# EAGLE board UHJ Ambisonic Decoder (EAGLE 9.0.1), part 1 of 2
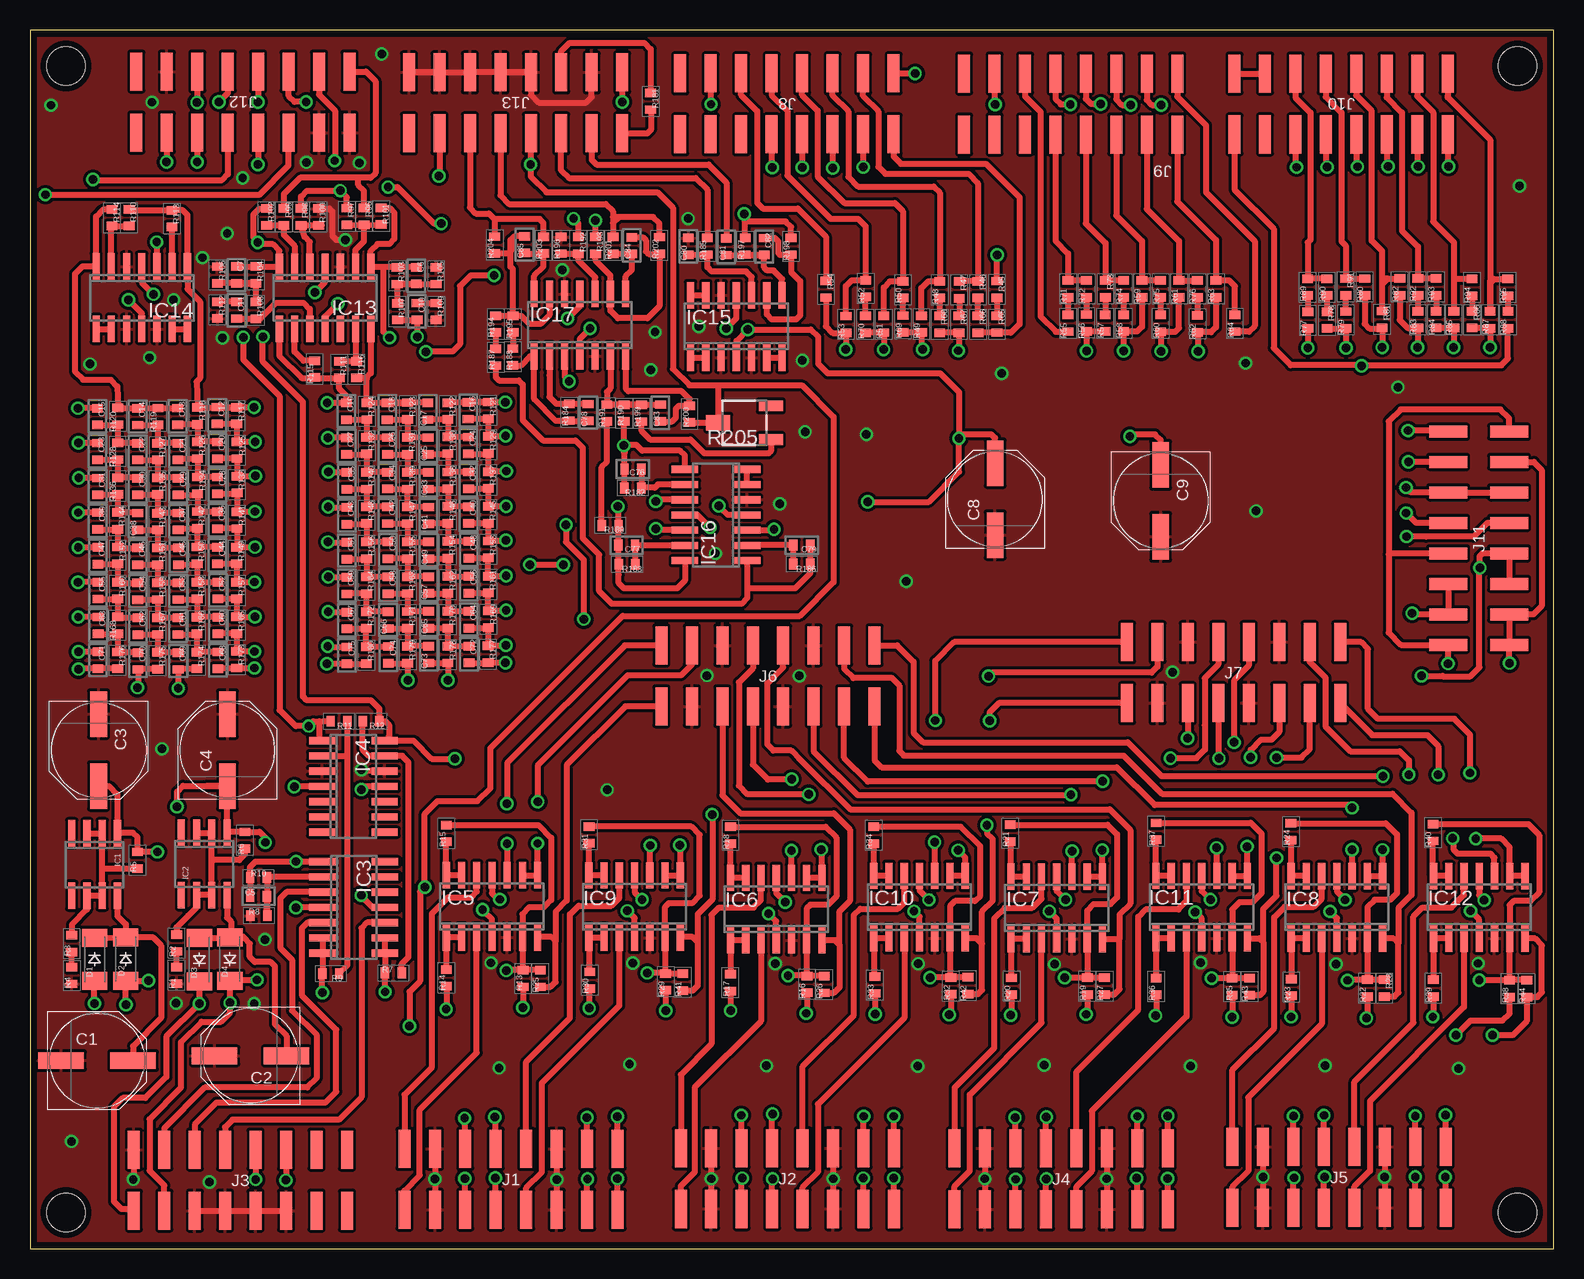
[diagram p5: board, top side]
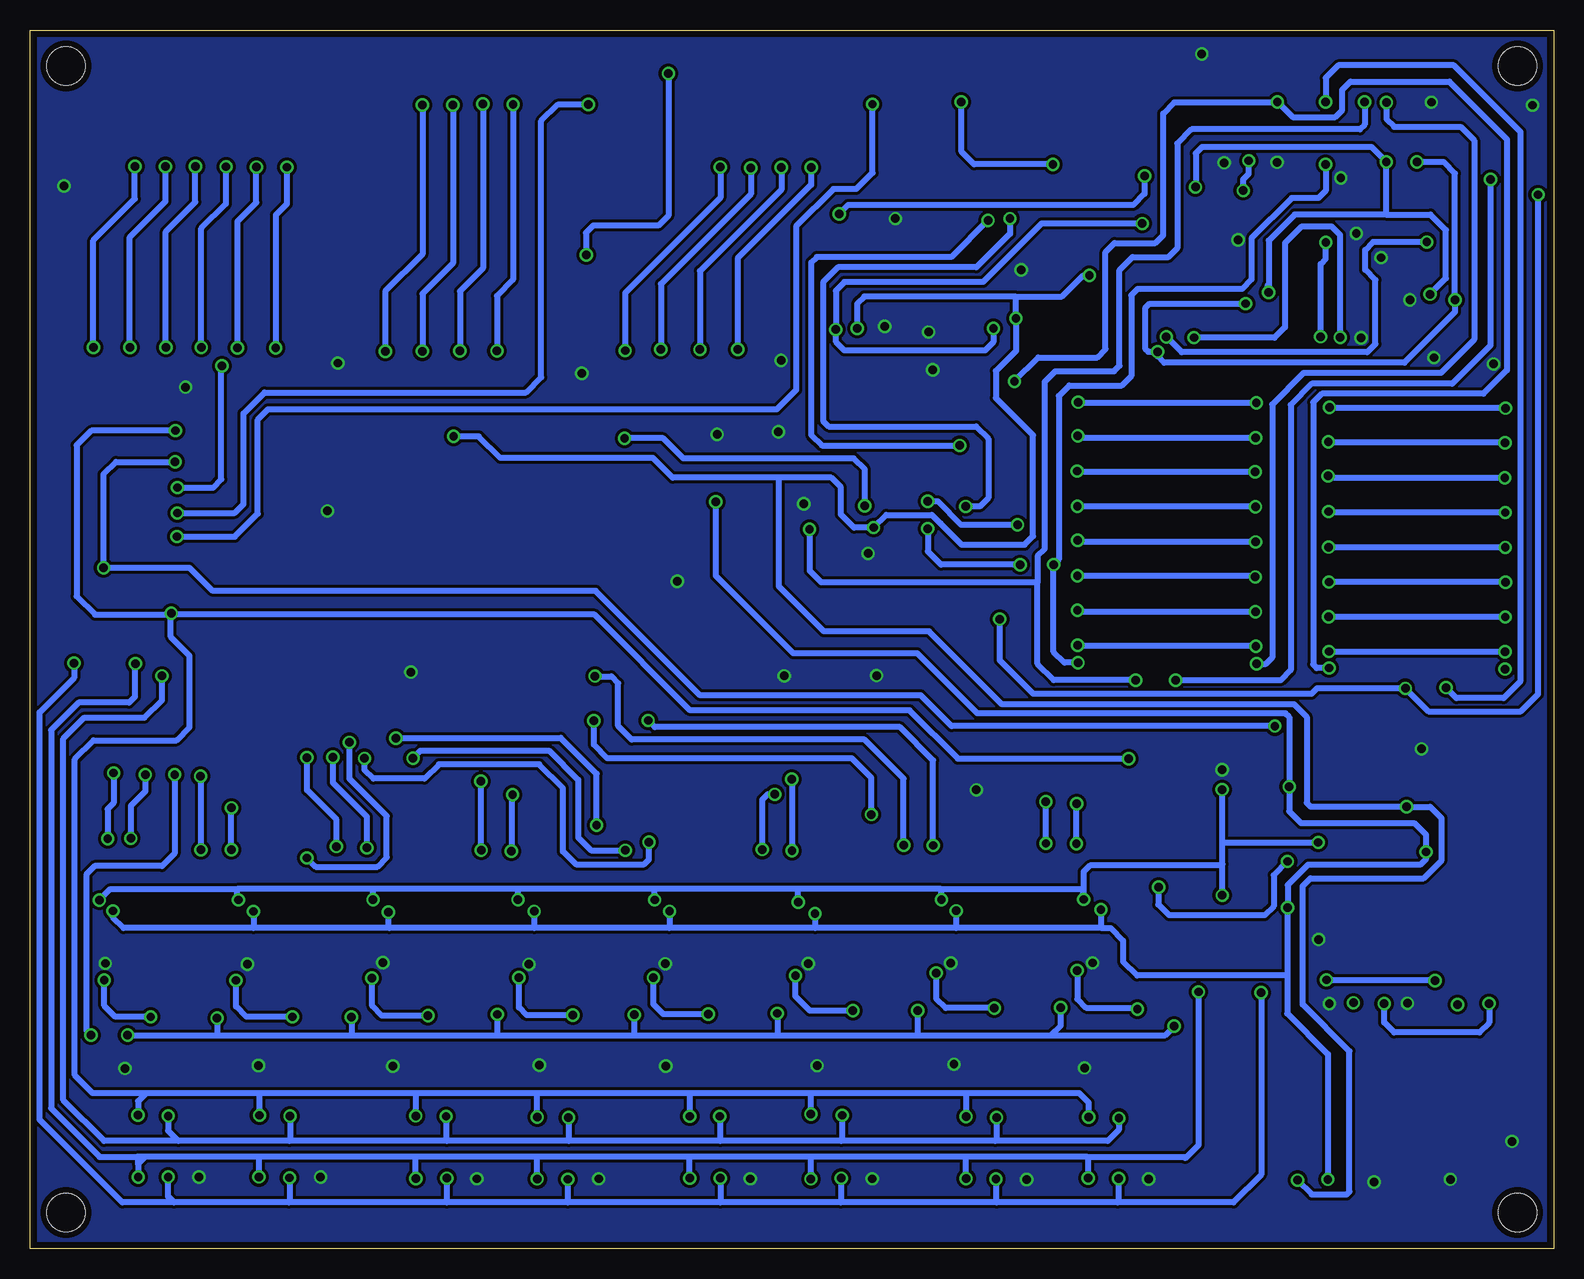
[diagram p6: board, bottom side, seen from below]

Size 127 x 101.6 mm. Coordinates in mm from the lower left corner, seen from the top.
Outline: 0,0 127,0 127,101.6 0,101.6 0,0
Copper layers (1*16): Top 0.035mm / dielectric 1.5mm / Bottom 0.035mm
Design rules "default *": minimum track width 6mil, minimum drill 0.2mm, track to track 10mil, track to pad 15mil, pad to pad 15mil, via to via 10mil, smd to smd 10mil, copper to edge 20mil, drill to drill 10mil, minimum pad ring 10mil, minimum via ring 8mil, stop-mask expansion 4mil, vias tented up to drill 0mil, thermal gap 10mil
Holes 3.2 mm at 3,98.6 124,98.6 3,3 124,3

## Footprints (pad centres in the part's own frame; a part is rotated, then mirrored left to right if it is on the bottom)
PANASONIC_E = smd 3.8 x 1.4: + 3,0; - -3,0
CT6032 = smd 0.7 x 0.9: + -0.7,0; - 0.7,0
SOD123 = smd 1.5 x 2.1: A 1.8,0; C -1.8,0
SO08 = smd 0.6 x 2.2: 1 -1.905,-2.6; 2 -0.635,-2.6; 3 0.635,-2.6; 4 1.905,-2.6; 5 1.905,2.6; 6 0.635,2.6; 7 -0.635,2.6; 8 -1.905,2.6
SO14 = smd 0.6 x 2.2: 1 -3.81,-2.6; 2 -2.54,-2.6; 3 -1.27,-2.6; 4 0,-2.6; 5 1.27,-2.6; 6 2.54,-2.6; 7 3.81,-2.6; 8 3.81,2.6; 9 2.54,2.6; 10 1.27,2.6; 11 0,2.6; 12 -1.27,2.6; 13 -2.54,2.6; 14 -3.81,2.6
2X08SMT = smd 1 x 3.17: 1 -8.89,-2.54; 2 -8.89,2.54; 3 -6.35,-2.54; 4 -6.35,2.54; 5 -3.81,-2.54; 6 -3.81,2.54; 7 -1.27,-2.54; 8 -1.27,2.54; 9 1.27,-2.54; 10 1.27,2.54; 11 3.81,-2.54; 12 3.81,2.54; 13 6.35,-2.54; 14 6.35,2.54; 15 8.89,-2.54; 16 8.89,2.54
R6332W = smd 0.7 x 0.9: 1 -0.7,0; 2 0.7,0
TRIM = smd 2 x 0.9: 1 -2.2,1.4; 3 -2.2,-1.4 | smd 2 x 1.3: 2 2.2,0

## Placement (x,y rotation side)
C1  470UF  [PANASONIC_E]  5.59,15.69 0 top
C2  470UF  [PANASONIC_E]  18.39,16.08 180 top
C3  10UF  [PANASONIC_E]  5.72,41.57 270 top
C4  10UF  [PANASONIC_E]  16.46,41.57 90 top
C5  22PF  [CT6032]  19.05,29.38 0 top
C6  C  [CT6032]  32.21,81.12 270 top
C7  C  [CT6032]  17.22,81.18 270 top
C8  C+  [PANASONIC_E]  80.45,62.49 90 top
C9  C+  [PANASONIC_E]  94.25,62.35 270 top
C10  C  [CT6032]  32.26,78.13 90 top
C11  C  [CT6032]  17.23,78.24 270 top
C12  100NF  [CT6032]  15.6,69.46 90 top
C13  100NF  [CT6032]  12.32,69.38 90 top
C14  100NF  [CT6032]  8.98,69.36 90 top
C15  100NF  [CT6032]  5.62,69.37 90 top
C16  100NF  [CT6032]  36.53,69.86 90 top
C17  100NF  [CT6032]  33.17,69.82 90 top
C18  100NF  [CT6032]  29.78,69.81 90 top
C19  100NF  [CT6032]  26.38,69.81 90 top
C20  47NF  [CT6032]  15.62,66.55 90 top
C21  47NF  [CT6032]  12.34,66.45 90 top
C22  47NF  [CT6032]  8.98,66.45 90 top
C23  47NF  [CT6032]  5.63,66.46 90 top
C24  47NF  [CT6032]  36.54,66.96 90 top
C25  47NF  [CT6032]  33.19,66.92 90 top
C26  47NF  [CT6032]  29.8,66.92 90 top
C27  47NF  [CT6032]  26.39,66.91 90 top
C28  22NF  [CT6032]  15.62,63.63 90 top
C29  22NF  [CT6032]  12.35,63.54 90 top
C30  22NF  [CT6032]  8.98,63.54 90 top
C31  22NF  [CT6032]  5.65,63.55 90 top
C32  22NF  [CT6032]  36.55,64.05 90 top
C33  22NF  [CT6032]  33.21,64.03 90 top
C34  22NF  [CT6032]  29.8,64.04 90 top
C35  22NF  [CT6032]  26.41,64.01 90 top
C36  12NF  [CT6032]  15.62,60.72 90 top
C37  12NF  [CT6032]  12.36,60.63 90 top
C38  12NF  [CT6032]  8.98,60.63 90 top
C39  12NF  [CT6032]  5.64,60.67 90 top
C40  12NF  [CT6032]  36.57,61.16 90 top
C41  12NF  [CT6032]  33.22,61.13 90 top
C42  12NF  [CT6032]  29.82,61.15 90 top
C43  12NF  [CT6032]  26.41,61.1 90 top
C44  6.8NF  [CT6032]  15.63,57.79 90 top
C45  6.8NF  [CT6032]  12.37,57.73 90 top
C46  6.8NF  [CT6032]  8.99,57.72 90 top
C47  6.8NF  [CT6032]  5.66,57.76 90 top
C48  6.8NF  [CT6032]  36.58,58.26 90 top
C49  6.8NF  [CT6032]  33.23,58.23 90 top
C50  6.8NF  [CT6032]  29.84,58.22 90 top
C51  6.8NF  [CT6032]  26.41,58.19 90 top
C52  3.3NF  [CT6032]  15.66,54.87 90 top
C53  3.3NF  [CT6032]  12.35,54.82 90 top
C54  3.3NF  [CT6032]  8.99,54.81 90 top
C55  3.3NF  [CT6032]  5.67,54.86 90 top
C56  3.3NF  [CT6032]  36.58,55.35 90 top
C57  3.3NF  [CT6032]  33.24,55.33 90 top
C58  3.3NF  [CT6032]  29.86,55.31 90 top
C59  3.3NF  [CT6032]  26.41,55.28 90 top
C60  1.5NF  [CT6032]  15.66,51.95 90 top
C61  1.5NF  [CT6032]  12.34,51.9 90 top
C62  1.5NF  [CT6032]  9,51.89 90 top
C63  1.5NF  [CT6032]  5.68,51.96 90 top
C64  1.5NF  [CT6032]  36.59,52.44 90 top
C65  1.5NF  [CT6032]  33.24,52.43 90 top
C66  1.5NF  [CT6032]  29.85,52.4 90 top
C67  1.5NF  [CT6032]  26.41,52.37 90 top
C68  820PF  [CT6032]  15.67,49.05 90 top
C69  820PF  [CT6032]  12.35,48.99 90 top
C70  820PF  [CT6032]  9,48.99 90 top
C71  820PF  [CT6032]  5.67,49.06 90 top
C72  820PF  [CT6032]  36.6,49.54 90 top
C73  820PF  [CT6032]  33.24,49.53 90 top
C74  820PF  [CT6032]  29.88,49.5 90 top
C75  820PF  [CT6032]  26.41,49.46 90 top
C76  22PF  [CT6032]  50.26,64.99 180 top
C77  22PF  [CT6032]  49.74,58.65 180 top
C78  22PF  [CT6032]  46.53,69.71 270 top
C79  22PF  [CT6032]  64.33,58.65 0 top
C80  6.8NF  [CT6032]  54.88,83.56 270 top
C81  15NF  [CT6032]  58.04,83.53 270 top
C82  47PF  [CT6032]  61.2,83.55 270 top
C83  47PF  [CT6032]  52.55,69.67 90 top
C84  47PF  [CT6032]  50.17,83.62 90 top
C85  47PF  [CT6032]  41.23,83.7 90 top
D1  1N4007  [SOD123]  5.39,24.13 270 top
D2  1N4007  [SOD123]  7.98,24.14 270 top
D3  1N4007  [SOD123]  14.12,24.1 90 top
D4  1N4007  [SOD123]  16.66,24.14 90 top
IC1  LM317  [SO08]  5.38,32.03 180 top
IC2  LM337  [SO08]  14.52,32.08 180 top
IC3  TL074D  [SO14]  26.99,28.46 270 top
IC4  TL074D  [SO14]  26.96,38.54 270 top
IC5  TL074D  [SO14]  38.51,28.54 0 top
IC6  TL074D  [SO14]  62.2,28.31 0 top
IC7  TL074D  [SO14]  85.59,28.41 0 top
IC8  TL074D  [SO14]  108.94,28.46 0 top
IC9  TL074D  [SO14]  50.4,28.52 0 top
IC10  TL074D  [SO14]  74.15,28.48 0 top
IC11  TL074D  [SO14]  97.67,28.48 0 top
IC12  TL074D  [SO14]  120.81,28.46 0 top
IC13  TL074D  [SO14]  24.6,79.27 180 top
IC14  TL074D  [SO14]  9.32,79.28 180 top
IC15  TL074D  [SO14]  58.88,76.88 0 top
IC16  TL074D  [SO14]  57.19,61.17 90 top
IC17  TL074D  [SO14]  45.84,77 0 top
J1  CON_16  [2X08SMT]  40.1,5.79 0 top
J2  CON_16  [2X08SMT]  63.14,5.85 0 top
J3  CON_16  [2X08SMT]  17.54,5.71 0 top
J4  CON_16  [2X08SMT]  85.96,5.82 0 top
J5  CON_16  [2X08SMT]  109.13,5.95 0 top
J6  CON_16  [2X08SMT]  61.52,47.75 0 top
J7  CON_16  [2X08SMT]  100.33,48.03 0 top
J8  CON_16  [2X08SMT]  63.09,95.44 180 top
J9  CON_16  [2X08SMT]  86.75,95.42 180 top
J10  CON_16  [2X08SMT]  109.29,95.43 180 top
J11  CON_16  [2X08SMT]  120.76,59.23 90 top
J12  CON_16  [2X08SMT]  17.75,95.59 180 top
J13  CON_16  [2X08SMT]  40.48,95.53 180 top
R1  150R  [R6332W]  12.22,22.79 90 top
R2  3.3K  [R6332W]  12.22,25.49 90 top
R3  3.3K  [R6332W]  3.48,25.44 90 top
R4  150R  [R6332W]  3.49,22.78 90 top
R5  330R  [R6332W]  8.96,32.38 90 top
R6  330R  [R6332W]  17.91,34.05 90 top
R7  2.2K  [R6332W]  30.29,22.99 180 top
R8  10K  [R6332W]  19.09,27.76 0 top
R9  2.2K  [R6332W]  25.07,22.94 180 top
R10  3.9K  [R6332W]  19.05,30.95 0 top
R11  2.2K  [R6332W]  25.76,43.97 0 top
R12  2.2K  [R6332W]  28.44,43.97 180 top
R13  2.2K  [R6332W]  41.1,22.53 270 top
R14  2.2K  [R6332W]  34.71,22.58 90 top
R15  2.2K  [R6332W]  34.7,34.62 270 top
R16  2.2K  [R6332W]  64.77,22.04 270 top
R17  2.2K  [R6332W]  58.39,22.19 90 top
R18  2.2K  [R6332W]  58.4,34.48 270 top
R19  2.2K  [R6332W]  88.14,21.9 270 top
R20  2.2K  [R6332W]  81.82,21.88 90 top
R21  2.2K  [R6332W]  81.7,34.64 270 top
R22  2.2K  [R6332W]  111.47,21.72 270 top
R23  2.2K  [R6332W]  105.15,21.79 90 top
R24  2.2K  [R6332W]  105.11,34.77 270 top
R25  2.2K  [R6332W]  42.54,22.53 90 top
R26  2.2K  [R6332W]  66.2,22.03 90 top
R27  2.2K  [R6332W]  89.57,21.9 90 top
R28  2.2K  [R6332W]  112.9,21.72 90 top
R29  2.2K  [R6332W]  52.99,22.25 270 top
R30  2.2K  [R6332W]  46.66,22.38 90 top
R31  2.2K  [R6332W]  46.6,34.5 270 top
R32  2.2K  [R6332W]  76.76,21.91 270 top
R33  2.2K  [R6332W]  70.43,21.99 90 top
R34  2.2K  [R6332W]  70.34,34.48 270 top
R35  2.2K  [R6332W]  100.21,21.85 270 top
R36  2.2K  [R6332W]  93.88,21.87 90 top
R37  2.2K  [R6332W]  93.87,34.8 270 top
R38  2.2K  [R6332W]  123.34,21.69 270 top
R39  2.2K  [R6332W]  116.98,21.72 90 top
R40  2.2K  [R6332W]  116.95,34.7 270 top
R41  2.2K  [R6332W]  54.41,22.23 90 top
R42  2.2K  [R6332W]  78.18,21.93 90 top
R43  2.2K  [R6332W]  101.66,21.85 90 top
R44  2.2K  [R6332W]  124.77,21.69 90 top
R45  1.5K  [R6332W]  80.6,79.96 270 top
R46  1.5K  [R6332W]  79.02,79.95 270 top
R47  1.3K  [R6332W]  77.46,79.94 270 top
R48  1.3K  [R6332W]  75.84,79.95 270 top
R49  1.2K  [R6332W]  74.31,77.08 270 top
R50  1K  [R6332W]  72.77,79.95 270 top
R51  820R  [R6332W]  71.17,77.07 270 top
R52  470R  [R6332W]  69.66,80.04 270 top
R53  360R  [R6332W]  68.02,77.05 270 top
R54  130R  [R6332W]  66.35,79.99 270 top
R55  1.5K  [R6332W]  86.53,77.15 90 top
R56  1.5K  [R6332W]  88.06,77.17 90 top
R57  1.3K  [R6332W]  89.62,77.16 90 top
R58  1.3K  [R6332W]  91.16,77.16 90 top
R59  1.2K  [R6332W]  92.69,80.02 90 top
R60  1K  [R6332W]  94.25,77.14 90 top
R61  820R  [R6332W]  95.78,80.01 90 top
R62  470R  [R6332W]  97.32,77.1 90 top
R63  360R  [R6332W]  98.86,80.02 90 top
R64  130R  [R6332W]  100.44,77.15 90 top
R65  56R  [R6332W]  80.6,77.07 270 top
R66  33R  [R6332W]  79.03,77.06 270 top
R67  150R  [R6332W]  77.44,77.06 270 top
R68  33R  [R6332W]  75.84,77.06 270 top
R69  33R  [R6332W]  72.77,77.09 270 top
R70  130R  [R6332W]  69.64,77.06 270 top
R71  56R  [R6332W]  86.53,80.02 90 top
R72  33R  [R6332W]  88.07,80.01 90 top
R73  150R  [R6332W]  89.65,80.01 90 top
R74  33R  [R6332W]  91.17,80.01 90 top
R75  33R  [R6332W]  94.24,80.01 90 top
R76  130R  [R6332W]  97.32,80.01 90 top
R77  820R  [R6332W]  106.52,77.41 90 top
R78  820R  [R6332W]  108.13,77.41 90 top
R79  820R  [R6332W]  109.69,77.42 90 top
R80  820R  [R6332W]  111.26,80.17 90 top
R81  750R  [R6332W]  112.71,77.46 90 top
R82  750R  [R6332W]  114.18,80.18 90 top
R83  560R  [R6332W]  115.69,77.45 90 top
R84  560R  [R6332W]  117.21,77.45 90 top
R85  560R  [R6332W]  118.69,77.45 90 top
R86  470R  [R6332W]  120.21,77.45 90 top
R87  470R  [R6332W]  121.71,77.44 90 top
R88  2.2K  [R6332W]  123.2,77.44 90 top
R89  150R  [R6332W]  106.5,80.16 90 top
R90  110R  [R6332W]  108.1,80.16 90 top
R91  56R  [R6332W]  109.68,80.17 90 top
R92  110R  [R6332W]  115.69,80.18 90 top
R93  75R  [R6332W]  117.2,80.18 90 top
R94  56R  [R6332W]  120.21,80.14 90 top
R95  33R  [R6332W]  123.19,80.14 90 top
R96  4.7K  [R6332W]  27.85,86.06 90 top
R97  4.7K  [R6332W]  26.41,86.05 90 top
R98  4.7K  [R6332W]  22.6,86.01 90 top
R99  4.7K  [R6332W]  21.16,86.01 90 top
R100  4.7K  [R6332W]  24.05,86.02 90 top
R101  4.7K  [R6332W]  29.28,86.08 270 top
R102  4.7K  [R6332W]  19.72,86.02 270 top
R103  15K  [R6332W]  30.61,81.11 90 top
R104  15K  [R6332W]  18.83,81.18 90 top
R105  10K  [R6332W]  33.85,81.11 90 top
R106  10K  [R6332W]  15.62,81.17 90 top
R107  22K  [R6332W]  30.64,78.12 90 top
R108  22K  [R6332W]  18.84,78.22 90 top
R109  15K  [R6332W]  33.86,78.13 270 top
R110  4.7K  [R6332W]  8.26,85.95 90 top
R111  4.7K  [R6332W]  25.79,73.29 270 top
R112  15K  [R6332W]  15.63,78.25 270 top
R113  4.7K  [R6332W]  11.84,85.87 270 top
R114  4.7K  [R6332W]  6.84,85.95 90 top
R115  4.7K  [R6332W]  23.73,73.33 90 top
R116  4.7K  [R6332W]  27.22,73.29 270 top
R117  12K  [R6332W]  17.23,69.45 90 top
R118  12K  [R6332W]  13.96,69.43 90 top
R119  12K  [R6332W]  10.66,69.38 90 top
R120  12K  [R6332W]  7.32,69.4 90 top
R121  12K  [R6332W]  38.2,69.88 90 top
R122  12K  [R6332W]  34.84,69.83 90 top
R123  12K  [R6332W]  31.49,69.84 90 top
R124  12K  [R6332W]  28.08,69.82 90 top
R125  12K  [R6332W]  17.25,66.57 90 top
R126  12K  [R6332W]  13.96,66.57 90 top
R127  12K  [R6332W]  10.65,66.45 90 top
R128  12K  [R6332W]  7.31,66.49 90 top
R129  12K  [R6332W]  38.2,67.02 90 top
R130  12K  [R6332W]  34.84,66.99 90 top
R131  12K  [R6332W]  31.49,66.94 90 top
R132  12K  [R6332W]  28.07,66.95 90 top
R133  12K  [R6332W]  17.26,63.7 90 top
R134  12K  [R6332W]  13.96,63.63 90 top
R135  12K  [R6332W]  10.64,63.58 90 top
R136  12K  [R6332W]  7.31,63.58 90 top
R137  12K  [R6332W]  38.2,64.08 90 top
R138  12K  [R6332W]  34.84,64.05 90 top
R139  12K  [R6332W]  31.49,64.03 90 top
R140  12K  [R6332W]  28.06,64.03 90 top
R141  12K  [R6332W]  17.25,60.74 90 top
R142  12K  [R6332W]  13.95,60.75 90 top
R143  12K  [R6332W]  10.64,60.62 90 top
R144  12K  [R6332W]  7.31,60.68 90 top
R145  12K  [R6332W]  38.2,61.18 90 top
R146  12K  [R6332W]  34.84,61.19 90 top
R147  12K  [R6332W]  31.49,61.15 90 top
R148  12K  [R6332W]  28.06,61.16 90 top
R149  12K  [R6332W]  17.24,57.79 90 top
R150  12K  [R6332W]  13.94,57.8 90 top
R151  12K  [R6332W]  10.64,57.73 90 top
R152  12K  [R6332W]  7.31,57.8 90 top
R153  12K  [R6332W]  38.2,58.3 90 top
R154  12K  [R6332W]  34.84,58.26 90 top
R155  12K  [R6332W]  31.49,58.22 90 top
R156  12K  [R6332W]  28.06,58.22 90 top
R157  12K  [R6332W]  17.24,54.87 90 top
R158  12K  [R6332W]  13.93,54.87 90 top
R159  12K  [R6332W]  10.64,54.82 90 top
R160  12K  [R6332W]  7.31,54.87 90 top
R161  12K  [R6332W]  38.2,55.37 90 top
R162  12K  [R6332W]  34.84,55.35 90 top
R163  12K  [R6332W]  31.49,55.32 90 top
R164  12K  [R6332W]  28.05,55.31 90 top
R165  12K  [R6332W]  17.24,51.98 90 top
R166  12K  [R6332W]  13.92,51.95 90 top
R167  12K  [R6332W]  10.65,51.9 90 top
R168  12K  [R6332W]  7.3,51.98 90 top
R169  12K  [R6332W]  38.2,52.48 90 top
R170  12K  [R6332W]  34.83,52.44 90 top
R171  12K  [R6332W]  31.49,52.42 90 top
R172  12K  [R6332W]  28.04,52.41 90 top
R173  12K  [R6332W]  17.24,49.11 90 top
R174  12K  [R6332W]  13.91,49.04 90 top
R175  12K  [R6332W]  10.64,49.01 90 top
R176  12K  [R6332W]  7.3,49.05 90 top
R177  12K  [R6332W]  38.19,49.56 90 top
R178  12K  [R6332W]  34.84,49.53 90 top
R179  12K  [R6332W]  31.49,49.52 90 top
R180  12K  [R6332W]  28.04,49.47 90 top
R181  82K  [R6332W]  51.74,95.65 270 top
R182  4.7K  [R6332W]  50.25,63.41 180 top
R183  4.7K  [R6332W]  49.77,57.06 180 top
R184  4.7K  [R6332W]  44.96,69.74 270 top
R185  82K  [R6332W]  56.46,83.57 270 top
R186  4.7K  [R6332W]  64.33,57.08 0 top
R187  560R  [R6332W]  38.82,74.32 90 top
R188  6.8K  [R6332W]  40.25,74.34 90 top
R189  5.6K  [R6332W]  48.36,60.3 180 top
R190  10K  [R6332W]  49.53,69.66 90 top
R191  56K  [R6332W]  48.09,69.67 90 top
R192  10K  [R6332W]  45.71,83.64 270 top
R193  24K  [R6332W]  47.15,83.64 270 top
R194  12K  [R6332W]  38.82,77.08 90 top
R195  47K  [R6332W]  40.26,77.08 90 top
R196  15K  [R6332W]  44.28,83.65 270 top
R197  47R  [R6332W]  59.62,83.57 90 top
R198  10K  [R6332W]  63.44,83.57 90 top
R199  3.3K  [R6332W]  50.98,69.65 270 top
R200  47R  [R6332W]  54.98,69.58 270 top
R201  47R  [R6332W]  48.6,83.64 90 top
R202  10K  [R6332W]  52.47,83.63 90 top
R203  47R  [R6332W]  42.81,83.66 90 top
R204  10K  [R6332W]  38.74,83.67 90 top
R205  TRIM  [TRIM]  59.56,68.86 180 top